# EAGLE design MotorBoardPrototyp4_ptcfuse (EAGLE 8.2.0)
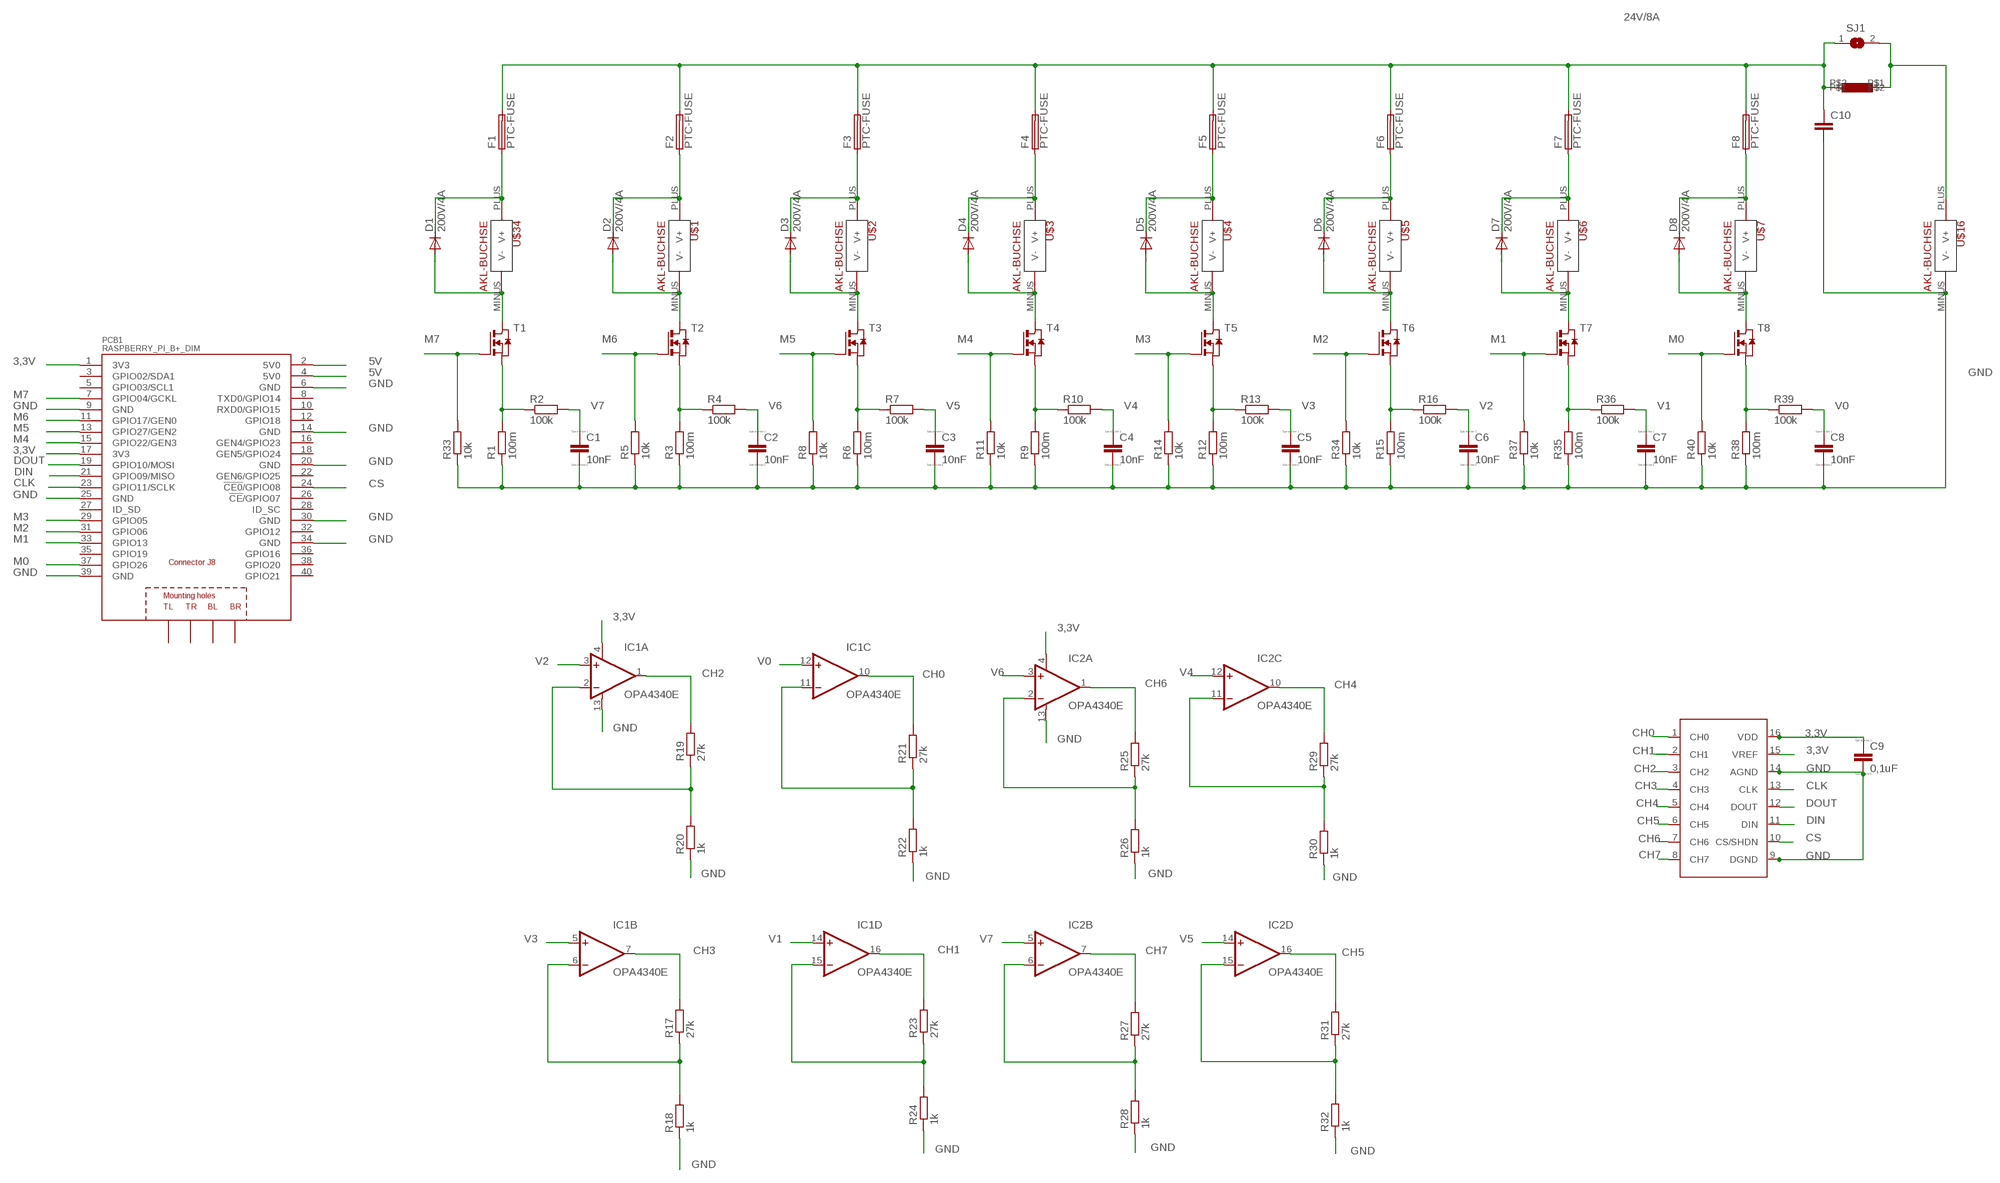
[diagram p0: schematic, sheet 1]

## Parts
C1  10nF  C  [C0805]
C2  10nF  C  [C0805]
C3  10nF  C  [C0805]
C4  10nF  C  [C0805]
C5  10nF  C  [C0805]
C6  10nF  C  [C0805]
C7  10nF  C  [C0805]
C8  10nF  C  [C0805]
C9  0,1uF  C  [C0805]
C10  C-EUC1812  [C1812]
D1  200V/4A  DIODE-DO214AA  [DO214AA]
D2  200V/4A  DIODE-DO214AA  [DO214AA]
D3  200V/4A  DIODE-DO214AA  [DO214AA]
D4  200V/4A  DIODE-DO214AA  [DO214AA]
D5  200V/4A  DIODE-DO214AA  [DO214AA]
D6  200V/4A  DIODE-DO214AA  [DO214AA]
D7  200V/4A  DIODE-DO214AA  [DO214AA]
D8  200V/4A  DIODE-DO214AA  [DO214AA]
F1  PTC-FUSE  [SMDF050]
F2  PTC-FUSE  [SMDF050]
F3  PTC-FUSE  [SMDF050]
F4  PTC-FUSE  [SMDF050]
F5  PTC-FUSE  [SMDF050]
F6  PTC-FUSE  [SMDF050]
F7  PTC-FUSE  [SMDF050]
F8  PTC-FUSE  [SMDF050]
IC1  OPA4340E  [SSOP16BU]
IC2  OPA4340E  [SSOP16BU]
L1  MPI4040  [4040]
PCB1  RASPBERRY_PI_B+_DIM  [RASPBERRY_PI_BPLUS_DIM]
R1  100m  R-EU_R0805  [R0805]
R2  100k  R-EU_R0805  [R0805]
R3  100m  R-EU_R0805  [R0805]
R4  100k  R-EU_R0805  [R0805]
R5  10k  R-EU_R0805  [R0805]
R6  100m  R-EU_R0805  [R0805]
R7  100k  R-EU_R0805  [R0805]
R8  10k  R-EU_R0805  [R0805]
R9  100m  R-EU_R0805  [R0805]
R10  100k  R-EU_R0805  [R0805]
R11  10k  R-EU_R0805  [R0805]
R12  100m  R-EU_R0805  [R0805]
R13  100k  R-EU_R0805  [R0805]
R14  10k  R-EU_R0805  [R0805]
R15  100m  R-EU_R0805  [R0805]
R16  100k  R-EU_R0805  [R0805]
R17  27k  R-EU_R0805  [R0805]
R18  1k  R-EU_R0805  [R0805]
R19  27k  R-EU_R0805  [R0805]
R20  1k  R-EU_R0805  [R0805]
R21  27k  R-EU_R0805  [R0805]
R22  1k  R-EU_R0805  [R0805]
R23  27k  R-EU_R0805  [R0805]
R24  1k  R-EU_R0805  [R0805]
R25  27k  R-EU_R0805  [R0805]
R26  1k  R-EU_R0805  [R0805]
R27  27k  R-EU_R0805  [R0805]
R28  1k  R-EU_R0805  [R0805]
R29  27k  R-EU_R0805  [R0805]
R30  1k  R-EU_R0805  [R0805]
R31  27k  R-EU_R0805  [R0805]
R32  1k  R-EU_R0805  [R0805]
R33  10k  R-EU_R0805  [R0805]
R34  10k  R-EU_R0805  [R0805]
R35  100m  R-EU_R0805  [R0805]
R36  100k  R-EU_R0805  [R0805]
R37  10k  R-EU_R0805  [R0805]
R38  100m  R-EU_R0805  [R0805]
R39  100k  R-EU_R0805  [R0805]
R40  10k  R-EU_R0805  [R0805]
SJ1  SJ  [SJ]
T1  NMOSSOT23  [SOT-23]
T2  NMOSSOT23  [SOT-23]
T3  NMOSSOT23  [SOT-23]
T4  NMOSSOT23  [SOT-23]
T5  NMOSSOT23  [SOT-23]
T6  NMOSSOT23  [SOT-23]
T7  NMOSSOT23  [SOT-23]
T8  NMOSSOT23  [SOT-23]
U$1  AKL-BUCHSE  [AKL-BUCHSE]
U$2  AKL-BUCHSE  [AKL-BUCHSE]
U$3  AKL-BUCHSE  [AKL-BUCHSE]
U$4  AKL-BUCHSE  [AKL-BUCHSE]
U$5  AKL-BUCHSE  [AKL-BUCHSE]
U$6  AKL-BUCHSE  [AKL-BUCHSE]
U$7  AKL-BUCHSE  [AKL-BUCHSE]
U$16  AKL-BUCHSE  [AKL-BUCHSE]
U$34  AKL-BUCHSE  [AKL-BUCHSE]
U$58  MCP3008SO16  [SO16]

## Nets
3,3V: C9.1 IC1.4(A:V+) IC2.4(A:V+) PCB1.1(3V3) PCB1.17(3V3) U$58.15(VREF) U$58.16(VDD)
5V: PCB1.2(5V0) PCB1.4(5V0)
24V/1A: D1.C F1.P$1 U$34.PLUS(V+)
24V/8A: C10.1 F1.P$2 F2.P$2 F3.P$2 F4.P$2 F5.P$2 F6.P$2 F7.P$2 F8.P$2 L1.P$2 SJ1.1
CH0: IC1.10(C:OUT) R21.2 U$58.1(CH0)
CH1: IC1.16(D:OUT) R23.2 U$58.2(CH1)
CH2: IC1.1(A:OUT) R19.2 U$58.3(CH2)
CH3: IC1.7(B:OUT) R17.2 U$58.4(CH3)
CH4: IC2.10(C:OUT) R29.2 U$58.5(CH4)
CH5: IC2.16(D:OUT) R31.2 U$58.6(CH5)
CH6: IC2.1(A:OUT) R25.2 U$58.7(CH6)
CH7: IC2.7(B:OUT) R27.2 U$58.8(CH7)
CLK: PCB1.23(GPIO11/SCLK) U$58.13(CLK)
CS: PCB1.24(!CE0!/GPIO08) U$58.10(CS/SHDN)
DIN: PCB1.21(GPIO09/MISO) U$58.11(DIN)
DOUT: PCB1.19(GPIO10/MOSI) U$58.12(DOUT)
GND: C1.2 C2.2 C3.2 C4.2 C5.2 C6.2 C7.2 C8.2 C9.2 C10.2 IC1.13(A:V-) IC2.13(A:V-) PCB1.6(GND) PCB1.9(GND) PCB1.14(GND) PCB1.20(GND) PCB1.25(GND) PCB1.30(GND) PCB1.34(GND) PCB1.39(GND) R1.1 R3.1 R5.1 R6.1 R8.1 R9.1 R11.1 R12.1 R14.1 R15.1 R18.1 R20.1 R22.1 R24.1 R26.1 R28.1 R30.1 R32.1 R33.1 R34.1 R35.1 R37.1 R38.1 R40.1 U$16.MINUS(V-) U$58.9(DGND) U$58.14(AGND)
M0: PCB1.37(GPIO26) R40.2 T8.3(G)
M1: PCB1.33(GPIO13) R37.2 T7.3(G)
M2: PCB1.31(GPIO06) R34.2 T6.3(G)
M3: PCB1.29(GPIO05) R14.2 T5.3(G)
M4: PCB1.15(GPIO22/GEN3) R11.2 T4.3(G)
M5: PCB1.13(GPIO27/GEN2) R8.2 T3.3(G)
M6: PCB1.11(GPIO17/GEN0) R5.2 T2.3(G)
M7: PCB1.7(GPIO04/GCKL) R33.2 T1.3(G)
N$2: D1.A T1.1(D) U$34.MINUS(V-)
N$3: R1.2 R2.1 T1.2(S)
N$4: D8.C F8.P$1 U$7.PLUS(V+)
N$5: D7.C F7.P$1 U$6.PLUS(V+)
N$6: IC1.2(A:-IN) R19.1 R20.2
N$7: D6.C F6.P$1 U$5.PLUS(V+)
N$8: D5.C F5.P$1 U$4.PLUS(V+)
N$9: D4.C F4.P$1 U$3.PLUS(V+)
N$10: D2.A T2.1(D) U$1.MINUS(V-)
N$11: R3.2 R4.1 T2.2(S)
N$12: D3.C F3.P$1 U$2.PLUS(V+)
N$13: D2.C F2.P$1 U$1.PLUS(V+)
N$15: IC1.6(B:-IN) R17.1 R18.2
N$17: D3.A T3.1(D) U$2.MINUS(V-)
N$18: R6.2 R7.1 T3.2(S)
N$22: IC1.11(C:-IN) R21.1 R22.2
N$26: D4.A T4.1(D) U$3.MINUS(V-)
N$27: IC1.15(D:-IN) R23.1 R24.2
N$28: L1.P$1 SJ1.2 U$16.PLUS(V+)
N$29: R9.2 R10.1 T4.2(S)
N$31: IC2.2(A:-IN) R25.1 R26.2
N$34: IC2.6(B:-IN) R27.1 R28.2
N$37: IC2.11(C:-IN) R29.1 R30.2
N$38: D5.A T5.1(D) U$4.MINUS(V-)
N$39: R12.2 R13.1 T5.2(S)
N$40: IC2.15(D:-IN) R31.1 R32.2
N$45: D6.A T6.1(D) U$5.MINUS(V-)
N$46: R15.2 R16.1 T6.2(S)
N$51: D7.A T7.1(D) U$6.MINUS(V-)
N$52: R35.2 R36.1 T7.2(S)
N$57: D8.A T8.1(D) U$7.MINUS(V-)
N$58: R38.2 R39.1 T8.2(S)
V0: C8.1 IC1.12(C:+IN) R39.2
V1: C7.1 IC1.14(D:+IN) R36.2
V2: C6.1 IC1.3(A:+IN) R16.2
V3: C5.1 IC1.5(B:+IN) R13.2
V4: C4.1 IC2.12(C:+IN) R10.2
V5: C3.1 IC2.14(D:+IN) R7.2
V6: C2.1 IC2.3(A:+IN) R4.2
V7: C1.1 IC2.5(B:+IN) R2.2
Unconnected: PCB1.3(GPIO02/SDA1) PCB1.5(GPIO03/SCL1) PCB1.8(TXD0/GPIO14) PCB1.10(RXD0/GPIO15) PCB1.12(GPIO18) PCB1.16(GEN4/GPIO23) PCB1.18(GEN5/GPIO24) PCB1.22(GEN6/GPIO25) PCB1.26(!CE!/GPIO07) PCB1.27(ID_SD) PCB1.28(ID_SC) PCB1.32(GPIO12) PCB1.35(GPIO19) PCB1.36(GPIO16) PCB1.38(GPIO20) PCB1.40(GPIO21) PCB1.PE_BL(BL) PCB1.PE_BR(BR) PCB1.PE_TL(TL) PCB1.PE_TR(TR)

## Library data of the parts
C1-C9 = eagle-ltspice:C: CAPACITOR, European symbol; SPICEMODEL: NONE; SPICEPREFIX: C
C10 = rcl:C-EU: CAPACITOR, European symbol
D1-D8 = diode:DIODE-: DIODE
F1-F8 = SMD-Fuse:PTC-FUSE
IC1 IC2 = burr-brown:OPA4340: Operational Amplifiers Source: http://focus.ti.com/lit/ds/sbos073/sbos073.pdf; MPN: OPA4340EA/250G4; OC_FARNELL: 1207061; OC_NEWARK: 67K8209
L1 = Spule:MPI4040
PCB1 = RASPBERRY_PI_GPIO:RASPBERRY_PI_B+: Raspberry Pi B+ Basedon issue: Thursday, July 10, 2014 - Rev 1.2 LBR by Tim Rettmann 07-2014
R1-R40 = rcl:R-EU_: RESISTOR, European symbol
SJ1 = jumper:SJ: SMD solder JUMPER
T1-T8 = zetex:NMOSSOT23: MOS FET; OC_FARNELL: unknown; OC_NEWARK: unknown
U$1-U$7 U$16 U$34 = Anschluss:AKL-BUCHSE
U$58 = MSC3008:MCP3008

## Board
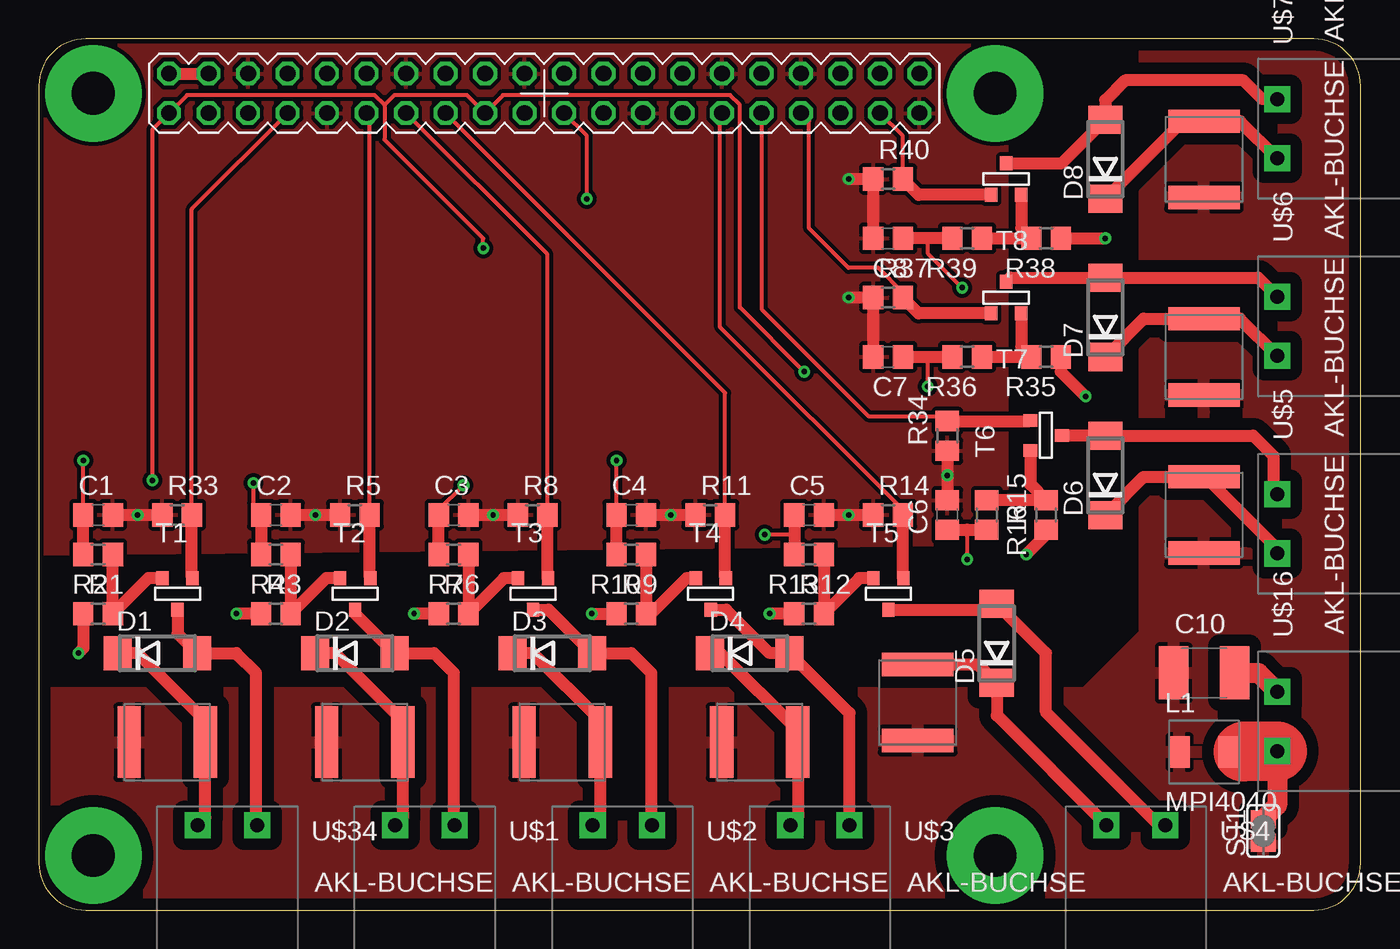
[diagram p1: board, top side]
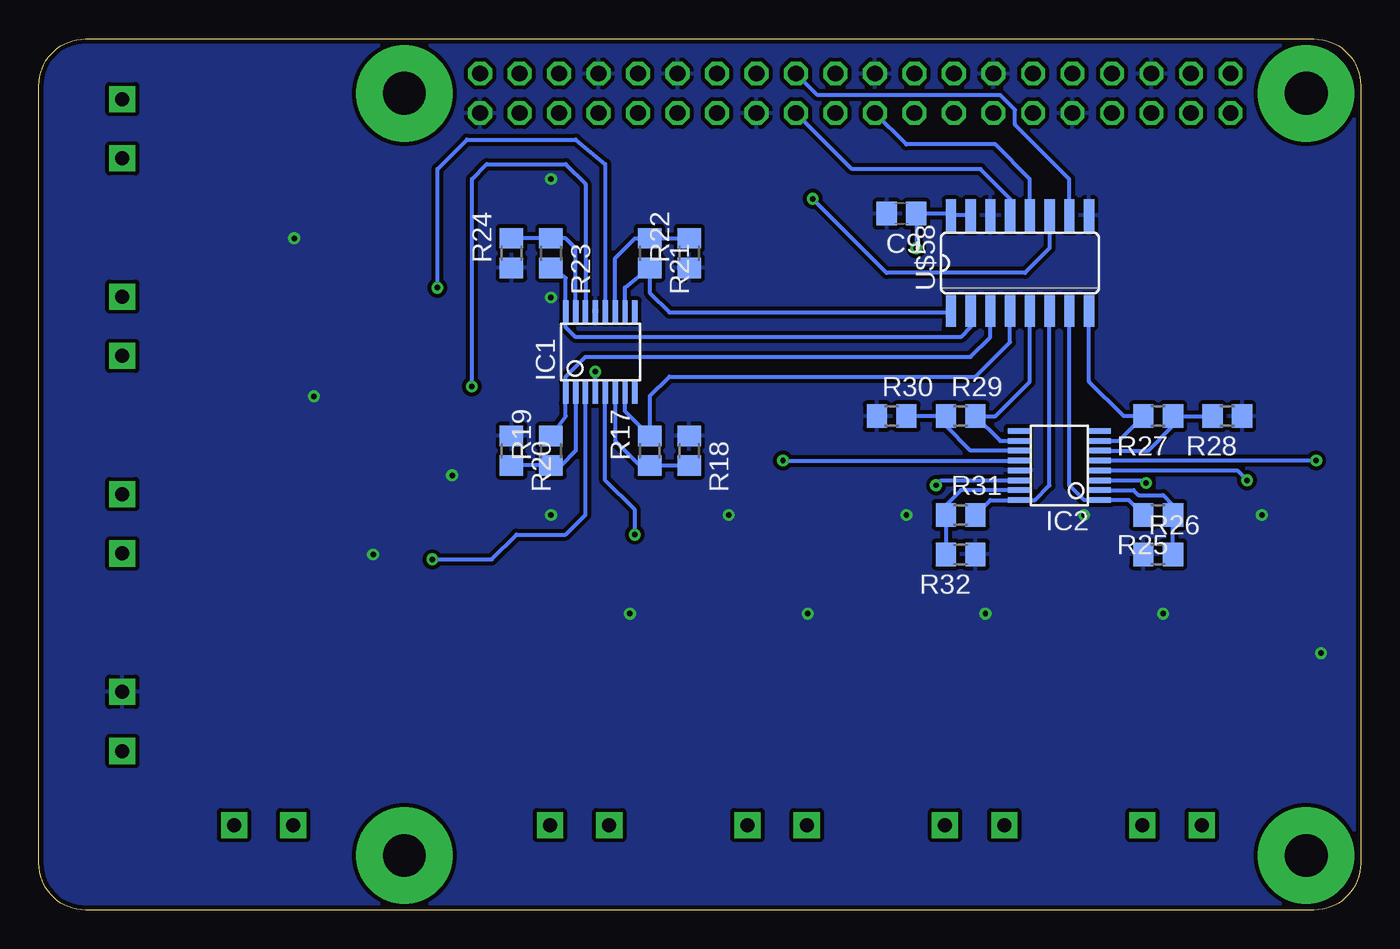
[diagram p2: board, bottom side, seen from below]

Size 85 x 56 mm. Coordinates in mm from the lower left corner, seen from the top.
Copper layers (1*16): Top 0.035mm / dielectric 1.5mm / Bottom 0.035mm
Design rules "default *": minimum track width 6mil, minimum drill 12mil, track to track 6mil, track to pad 6mil, pad to pad 6mil, via to via 6mil, smd to smd 6mil, copper to edge 12mil, drill to drill 6mil, minimum pad ring 10mil, minimum via ring 8mil, stop-mask expansion 4mil, vias tented up to drill 0mil, thermal gap 10mil

### Footprints (pad centres in the part's own frame; a part is rotated, then mirrored left to right if it is on the bottom)
C0805 = smd 1.3 x 1.5: 1 -0.95,0; 2 0.95,0
C1812 = smd 1.9 x 3.4: 1 -1.95,0; 2 1.95,0
DO214AA = smd 1.8 x 2.2: A 2.55,0; C -2.55,0
SMDF050 = smd 1.5 x 4.6: P$1 -2.45,0; P$2 2.45,0
SSOP16BU = smd 0.348 x 1.397: 1 -2.223,-2.619; 2 -1.588,-2.62; 3 -0.953,-2.62; 4 -0.318,-2.62; 5 0.318,-2.62; 6 0.953,-2.62; 7 1.588,-2.62; 8 2.223,-2.62; 9 2.223,2.62; 10 1.588,2.62; 11 0.953,2.62; 12 0.318,2.62; 13 -0.318,2.62; 14 -0.953,2.62; 15 -1.588,2.62; 16 -2.223,2.62
4040 = smd 2 x 1.3: P$1 0,1.575; P$2 0,-1.575
RASPBERRY_PI_BPLUS_DIM = drill 1.016 octagon: 1 8.37,51.23; 2 8.37,53.77; 3 10.91,51.23; 4 10.91,53.77; 5 13.45,51.23; 6 13.45,53.77; 7 15.99,51.23; 8 15.99,53.77; 9 18.53,51.23; 10 18.53,53.77; 11 21.07,51.23; 12 21.07,53.77; 13 23.61,51.23; 14 23.61,53.77; 15 26.15,51.23; 16 26.15,53.77; 17 28.69,51.23; 18 28.69,53.77; 19 31.23,51.23; 20 31.23,53.77; 21 33.77,51.23; 22 33.77,53.77; 23 36.31,51.23; 24 36.31,53.77; 25 38.85,51.23; 26 38.85,53.77; 27 41.39,51.23; 28 41.39,53.77; 29 43.93,51.23; 30 43.93,53.77; 31 46.47,51.23; 32 46.47,53.77; 33 49.01,51.23; 34 49.01,53.77; 35 51.55,51.23; 36 51.55,53.77; 37 54.09,51.23; 38 54.09,53.77; 39 56.63,51.23; 40 56.63,53.77 | drill 2.75 pad 6.2: PE_BL 3.5,3.5; PE_BR 61.5,3.5; PE_TL 3.5,52.5; PE_TR 61.5,52.5
R0805 = smd 1.3 x 1.5: 1 -0.95,0; 2 0.95,0
SJ = smd 1.168 x 1.6: 1 -0.762,0; 2 0.762,0
SOT-23 = smd 0.787 x 0.889: 1 0.025,-1.016; 2 -0.94,1.016; 3 0.991,1.016
AKL-BUCHSE = drill 0.9 pad 1.676 square: MINUS 6.41,8; PLUS 2.6,8
SO16 = smd 0.66 x 2.032: 1 -4.445,-3.073; 2 -3.175,-3.073; 3 -1.905,-3.073; 4 -0.635,-3.073; 5 0.635,-3.073; 6 1.905,-3.073; 7 3.175,-3.073; 8 4.445,-3.073; 9 4.445,3.073; 10 3.175,3.073; 11 1.905,3.073; 12 0.635,3.073; 13 -0.635,3.073; 14 -1.905,3.073; 15 -3.175,3.073; 16 -4.445,3.073

### Placement (x,y rotation side)
C1  3.81,25.4 0 top
C2  15.24,25.4 0 top
C3  26.67,25.4 0 top
C4  38.1,25.4 0 top
C5  49.53,25.4 0 top
C6  58.42,25.4 90 top
C7  54.61,35.56 180 top
C8  54.61,43.18 180 top
C9  29.53,44.77 180 bottom
C10  74.93,15.24 0 top
D1  7.62,16.51 0 top
D2  20.32,16.51 0 top
D3  33.02,16.51 0 top
D4  45.72,16.51 0 top
D5  61.59,17.14 90 top
D6  68.58,27.94 90 top
D7  68.58,38.1 90 top
D8  68.58,48.26 90 top
F1  8.26,10.79 180 top
F2  20.95,10.79 180 top
F3  33.66,10.79 180 top
F4  46.35,10.79 180 top
F5  56.52,13.34 270 top
F6  74.93,25.4 270 top
F7  74.93,35.56 270 top
F8  74.93,48.26 270 top
IC1  48.9,35.88 0 bottom
IC2  19.37,28.57 90 bottom
L1  74.93,10.16 270 top
PCB1  0,0 0 top
R1  3.81,19.05 0 top
R2  3.81,22.86 180 top
R3  15.24,19.05 0 top
R4  15.24,22.86 180 top
R5  20.32,25.4 0 top
R6  26.67,19.05 0 top
R7  26.67,22.86 180 top
R8  31.75,25.4 0 top
R9  38.1,19.05 0 top
R10  38.1,22.86 180 top
R11  43.18,25.4 0 top
R12  49.53,19.05 0 top
R13  49.53,22.86 180 top
R14  54.61,25.4 0 top
R15  64.77,25.4 90 top
R16  60.96,25.4 270 top
R17  45.72,29.53 90 bottom
R18  43.18,29.53 270 bottom
R19  52.07,29.53 90 bottom
R20  54.61,29.53 270 bottom
R21  45.72,42.23 270 bottom
R22  43.18,42.23 90 bottom
R23  52.07,42.23 270 bottom
R24  54.61,42.23 90 bottom
R25  13.02,25.4 180 bottom
R26  13.02,22.86 0 bottom
R27  13.02,31.75 180 bottom
R28  8.57,31.75 180 bottom
R29  25.72,31.75 0 bottom
R30  30.16,31.75 0 bottom
R31  25.72,25.4 0 bottom
R32  25.72,22.86 180 bottom
R33  8.89,25.4 0 top
R34  58.42,30.48 90 top
R35  64.77,35.56 180 top
R36  59.69,35.56 180 top
R37  54.61,39.37 0 top
R38  64.77,43.18 180 top
R39  59.69,43.18 180 top
R40  54.61,46.99 0 top
SJ1  78.74,5.08 90 top
T1  8.89,20.32 0 top
T2  20.32,20.32 0 top
T3  31.75,20.32 0 top
T4  43.18,20.32 0 top
T5  54.61,20.32 0 top
T6  64.77,30.48 90 top
T7  62.23,39.37 180 top
T8  62.23,46.99 180 top
U$1  20.32,-2.54 0 top
U$2  33.02,-2.54 0 top
U$3  45.72,-2.54 0 top
U$4  66.04,-2.54 0 top
U$5  87.63,20.32 90 top
U$6  87.63,33.02 90 top
U$7  87.63,45.72 90 top
U$16  87.63,7.62 90 top
U$34  7.62,-2.54 0 top
U$58  21.91,41.59 0 bottom

### Tracks (layer width: path | path; a pad name or v marks a point on that pad's centre or on a via)
3,3V  (via drill 0.35)
  Top 0.254: v28.57,42.55 28.57,43.18 22.23,49.53 22.23,51.75 | 22.23,51.75 21.59,52.39 9.53,52.39 PCB1.1 7.3,50.16 v7.3,27.62 | v49.21,34.61 45.09,38.73 45.09,51.75 44.45,52.39 29.84,52.39 PCB1.17 27.53,52.39 22.86,52.39 22.23,51.75
  Bottom 0.254: U$58.15 U$58.16 26.45,44.77 C9.1 v28.58,42.55 v28.57,42.55 | IC1.4 v49.21,34.61 | IC2.4 7.94,28.26 v7.3,27.62
5V
  Top 0.762: PCB1.2 PCB1.4
24V/1A
  Top 0.762: U$34.PLUS 10.71,5.95 F1.P$1 10.71,12.15 6.35,16.51 D1.C
24V/8A
  pour Top (isolate 0.762): 0,13.97 67.31,13.97 71.12,17.78 71.12,55.88 85.09,55.88 85.09,0 0,0
CH0
  Bottom 0.254: IC1.10 47.31,40.01 R21.2 45.72,39.69 44.45,38.42 26.45,38.42 U$58.1
CH1
  Bottom 0.254: R23.2 51.12,40.64 IC1.16 51.12,38.81 51.12,37.47 50.48,36.83 25.72,36.83 25.08,37.47 U$58.2
CH2
  Bottom 0.254: R19.2 51.12,31.75 IC1.1 51.12,34.29 49.85,35.56 25.08,35.56 23.81,36.83 U$58.3
CH3
  Bottom 0.254: U$58.4 22.54,36.51 24.77,34.29 44.45,34.29 45.72,33.02 R17.2 47.31,32.06 IC1.7
CH4
  Bottom 0.254: IC2.10 23.18,30.16 R29.2 23.5,31.75 21.27,33.97 U$58.5
CH5
  Bottom 0.254: R31.2 23.82,26.35 IC2.16 20.96,26.35 20,27.3 U$58.6
CH6
  Bottom 0.254: R25.2 14.92,26.35 IC2.1 17.78,26.35 18.73,27.3 U$58.7
CH7
  Bottom 0.254: IC2.7 15.55,30.16 R27.2 15.24,31.75 17.46,33.97 U$58.8
CLK
  Bottom 0.254: U$58.13 22.54,45.72 24.45,47.62 32.7,47.62 PCB1.23
CS
  Bottom 0.254: U$58.10 18.73,46.99 22.23,50.48 22.23,51.44 23.18,52.39 34.93,52.39 PCB1.24
DIN  (via drill 0.35)
  Top 0.254: v35.24,45.72 35.24,49.76 PCB1.21
  Bottom 0.254: U$58.11 20,42.55 21.59,40.96 30.48,40.96 v35.24,45.72
DOUT
  Bottom 0.254: U$58.12 21.27,46.99 23.5,49.21 29.21,49.21 PCB1.19
GND  (via drill 0.35)
  Top 0.762: v35.56,19.05 R9.1 | R1.1 2.86,16.83 v2.54,16.51 | C1.2 v6.35,25.4 R33.1 | C2.2 v17.78,25.4 R5.1 | C3.2 v29.21,25.4 R8.1 | C4.2 v40.64,25.4 R11.1 | C5.2 v52.07,25.4 R14.1 | R3.1 v12.7,19.05 | R6.1 v24.13,19.05 | R12.1 v46.99,19.05 | R34.1 v58.42,27.94 C6.2 | R15.1 64.77,24.13 v63.5,22.86 | C8.2 R40.1 v52.07,46.99 | C7.2 R37.1 v52.07,39.37 | R35.1 65.72,34.61 v67.31,33.02 | R38.1 v68.58,43.18
  Top 1.27: C10.2 78.42,15.24 U$16.MINUS
  pour Bottom (isolate 0.254): -2.54,58.42 95.25,58.42 95.25,-3.81 -2.54,-3.81
  pour Top (isolate 0.254): 0,56.52 62.23,56.52 62.23,26.67 59.05,23.5 -0.64,22.86 -0.64,55.88
M0
  Top 0.254: R40.2 55.56,49.76 PCB1.37
  Top 0.762: T8.3 56.58,45.97 R40.2
M1
  Top 0.254: R37.2 55.56,39.69 53.98,41.27 52.07,41.27 49.53,43.81 49.53,50.71 PCB1.33
  Top 0.762: T7.3 56.58,38.35 R37.2
M2
  Top 0.254: PCB1.31 46.47,38.62 53.34,31.75 58.1,31.75 R34.2
  Top 0.762: R34.2 63.71,31.43 T6.3
M3
  Top 0.254: R14.2 55.56,25.72 43.81,37.47 43.81,51.12 PCB1.29
  Top 0.762: R14.2 55.56,21.38 T5.3
M4
  Top 0.254: R11.2 44.13,33.25 PCB1.15
  Top 0.762: R11.2 44.13,21.38 T4.3
M5
  Top 0.254: R8.2 32.7,42.14 PCB1.13
  Top 0.762: R8.2 32.7,21.38 T3.3
M6
  Top 0.254: R5.2 21.27,51.03 PCB1.11
  Top 0.762: R5.2 21.27,21.38 T2.3
M7
  Top 0.254: R33.2 9.84,45.08 PCB1.7
  Top 0.762: R33.2 9.84,21.38 T1.3
N$2
  Top 0.762: U$34.MINUS 13.97,5.52 13.97,15.24 12.7,16.51 D1.A 8.91,17.77 T1.1
N$3
  Top 0.762: R2.1 R1.2 7.05,21.34 T1.2
N$4
  Top 0.762: D8.C 73.58,50.71 F8.P$1 77.24,50.71 U$7.PLUS
N$5
  Top 0.762: D7.C 71.04,38.01 F7.P$1 77.24,38.01 U$6.PLUS
N$6
  Bottom 0.254: R20.2 R19.1 51.44,28.57 50.48,29.53 IC1.2
N$7
  Top 0.762: D6.C 71.04,27.85 F6.P$1 75.02,27.85 79.38,23.5 79.38,23.18 U$5.PLUS
N$8
  Top 0.762: U$4.PLUS 61.59,12.51 D5.C 60.4,15.79 F5.P$1
N$9
  Top 0.762: D4.C 43.81,16.51 48.8,11.52 F4.P$1 48.8,5.95 U$3.PLUS
N$10
  Top 0.762: U$1.MINUS 26.67,5.52 26.67,15.24 25.4,16.51 D2.A 20.34,19.04 T2.1
N$11
  Top 0.762: T2.2 18.48,21.34 R3.2 R4.1
N$12
  Top 0.762: U$2.PLUS 36.1,5.95 F3.P$1 36.1,12.15 31.75,16.51 D3.C
N$13
  Top 0.762: D2.C 19.05,16.51 23.41,12.15 F2.P$1 23.41,5.95 U$1.PLUS
N$15
  Bottom 0.254: R18.2 R17.1 46.35,28.57 47.94,30.16 IC1.6
N$17
  Top 0.762: U$2.MINUS 39.37,5.52 39.37,15.24 38.1,16.51 D3.A 32.78,19.3 T3.1
N$18
  Top 0.762: T3.2 29.91,21.34 R6.2 R7.1
N$22
  Bottom 0.254: R22.2 R21.1 46.67,43.18 47.94,41.91 IC1.11
N$26
  Top 0.762: T4.1 44.2,19.3 46.99,16.51 D4.A 52.13,12.65 U$3.MINUS
N$27
  Bottom 0.254: R24.2 R23.1 51.12,43.18 50.48,42.55 IC1.15
N$28
  Top 0.762: 77.53,10.22 76.56,10.22 L1.P$1
  Top 1.27: U$16.PLUS 79.63,6.73 SJ1.2
  Top 3.81: U$16.PLUS 77.53,10.22 77.47,10.16
N$29
  Top 0.762: T4.2 41.66,21.34 39.37,19.05 R9.2 R10.1
N$31
  Bottom 0.254: R26.2 R25.1 12.07,26.03 12.06,26.04 12.7,26.67 14.29,26.67 14.61,26.99 IC2.2
N$34
  Bottom 0.254: R28.2 R27.1 12.06,31.11 13.65,29.53 IC2.6
N$37
  Bottom 0.254: R30.2 R29.1 26.67,31.11 25.08,29.53 IC2.11
N$38
  Top 0.762: T5.1 61.2,19.3 D5.A 62.23,19.06 62.23,19.05 64.77,16.51 64.77,12.7 72.01,5.46 U$4.MINUS
N$39
  Top 0.762: T5.2 52.77,21.34 R12.2 R13.1
N$40
  Bottom 0.254: R32.2 R31.1 26.67,26.04 25.72,26.99 IC2.15
N$45
  Top 0.762: T6.1 68.56,30.5 D6.A 78.09,30.49 79.38,29.21 79.38,26.98 U$5.MINUS
N$46
  Top 0.762: T6.2 63.75,27.37 R15.2 R16.1
N$51
  Top 0.762: T7.1 62.47,40.65 D7.A 78.41,40.65 U$6.MINUS
N$52
  Top 0.762: T7.2 63.17,36.21 R35.2 R36.1
N$57
  Top 0.762: T8.1 65.78,48.01 D8.A 68.58,52.07 69.85,53.34 77.47,53.34 78.68,52.13 U$7.MINUS
N$58
  Top 0.762: T8.2 63.17,43.83 R38.2 R39.1
V0  (via drill 0.35)
  Top 0.254: 57.15,43.18 57.15,42.23 v59.37,40.01
  Top 0.762: R39.2 57.15,43.18 C8.1
  Bottom 0.254: v59.37,40.01 59.37,47.62 57.47,49.53 50.48,49.53 48.58,47.94 48.58,38.82 IC1.12
V1  (via drill 0.35)
  Top 0.254: 57.15,35.56 v57.15,33.66
  Top 0.762: C7.1 57.15,35.56 R36.2
  Bottom 0.254: v57.15,33.66 57.15,46.99 56.2,47.94 51.12,47.94 49.85,46.67 49.85,38.82 IC1.14
V2  (via drill 0.35)
  Top 0.254: 59.69,24.45 v59.69,22.54
  Top 0.762: C6.1 59.69,24.45 R16.2
  Bottom 0.254: v59.69,22.54 55.88,22.54 54.29,24.13 51.12,24.13 49.85,25.4 49.85,33.58 IC1.3
V3  (via drill 0.35)
  Top 0.254: 48.58,24.13 v46.67,24.13
  Top 0.762: C5.1 48.58,24.13 R13.2
  Bottom 0.254: v46.67,24.13 46.67,25.72 48.58,27.62 48.58,33.58 IC1.5
V4  (via drill 0.35)
  Top 0.254: C4.1 v37.15,28.89
  Top 0.762: R10.2 C4.1
  Bottom 0.254: v37.15,28.89 IC2.12
V5  (via drill 0.35)
  Top 0.254: C3.1 25.72,25.72 v27.3,27.3
  Top 0.762: R7.2 C3.1
  Bottom 0.254: v27.3,27.3 26.99,27.62 IC2.14 | IC2.14
V6  (via drill 0.35)
  Top 0.254: v13.79,27.46 13.79,25.9 C2.1
  Top 0.762: C2.1 R4.2
  Bottom 0.254: IC2.3 13.96,27.62 v13.79,27.46
V7  (via drill 0.35)
  Top 0.254: C1.1 v2.86,28.89
  Top 0.762: R2.2 C1.1
  Bottom 0.254: v2.86,28.89 IC2.5